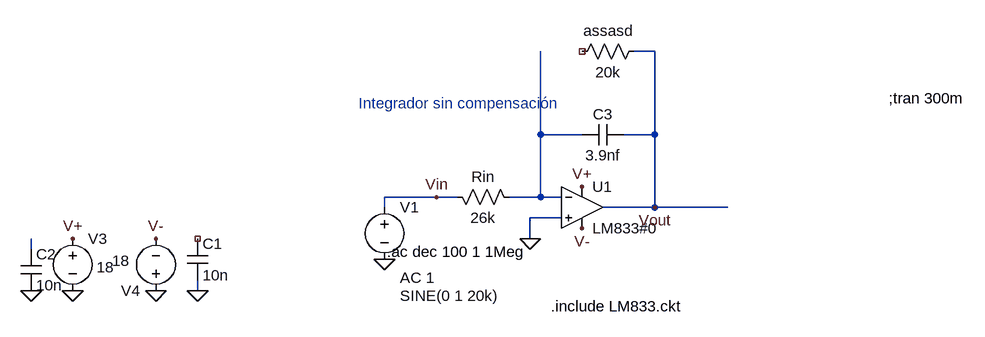
[diagram p0: schematic Integrador sin compensación.asc]
Integrador sin compensación.asc, the LTspice schematic file:
Version 4
SHEET 1 880 680
WIRE -656 -64 -688 -64
WIRE -832 64 -832 -64
WIRE -768 64 -832 64
WIRE -656 64 -656 -64
WIRE -656 64 -704 64
WIRE -992 160 -1072 160
WIRE -960 160 -992 160
WIRE -832 160 -832 64
WIRE -832 160 -880 160
WIRE -800 160 -832 160
WIRE -1072 176 -1072 160
WIRE -656 176 -656 64
WIRE -656 176 -736 176
WIRE -544 176 -656 176
WIRE -800 192 -848 192
WIRE -848 224 -848 192
WIRE -1616 240 -1616 224
WIRE -1360 304 -1360 288
FLAG -848 224 0
FLAG -768 208 V-
FLAG -656 176 Vout
FLAG -768 144 V+
FLAG -1424 304 0
FLAG -1552 304 0
FLAG -1552 224 V+
FLAG -1424 224 V-
FLAG -1072 256 0
FLAG -1616 304 0
FLAG -1360 304 0
FLAG -992 160 Vin
SYMBOL Opamps\\opamp2 -768 112 R0
SYMATTR InstName U1
SYMATTR Value LM833#0
SYMBOL res -976 144 M90
WINDOW 0 0 56 VBottom 2
WINDOW 3 32 56 VTop 2
SYMATTR InstName Rin
SYMATTR Value 26k
SYMBOL voltage -1552 208 R0
WINDOW 3 37 60 Left 2
WINDOW 123 0 0 Left 0
WINDOW 39 0 0 Left 0
SYMATTR Value 18
SYMATTR InstName V3
SYMBOL voltage -1424 320 R180
WINDOW 3 40 62 Left 2
WINDOW 123 0 0 Left 0
WINDOW 39 0 0 Left 0
SYMATTR Value 18
SYMATTR InstName V4
SYMBOL cap -768 80 R270
WINDOW 0 32 32 VTop 2
WINDOW 3 0 32 VBottom 2
SYMATTR InstName C3
SYMATTR Value 3.9nf
SYMBOL cap -1376 224 R0
SYMATTR InstName C1
SYMATTR Value 10n
SYMBOL cap -1632 240 R0
SYMATTR InstName C2
SYMATTR Value 10n
SYMBOL res -672 -80 R90
WINDOW 0 0 56 VBottom 2
WINDOW 3 32 56 VTop 2
SYMATTR InstName assasd
SYMATTR Value 20k
SYMBOL voltage -1072 160 R0
WINDOW 3 24 152 Left 2
WINDOW 123 24 124 Left 2
WINDOW 39 0 0 Left 0
SYMATTR InstName V1
SYMATTR Value SINE(0 1 20k)
SYMATTR Value2 AC 1
TEXT -816 328 Left 2 !.include LM833.ckt
TEXT -1112 16 Left 2 ;Integrador sin compensación
TEXT -1068 244 Left 2 !.ac dec 100 1 1Meg
TEXT -296 8 Left 2 !;tran 300m

The netlist it stands for:
* Integrador sin compensación.asc
XU1 0 N001 V+ V- Vout LM833#0  ; pins In+ In- V+ V- OUT
Rin Vin N001 26k
V3 V+ 0 18
V4 0 V- 18
C3 N001 Vout 3.9nf
C1 NC_01 0 10n
C2 N002 0 10n
R§assasd Vout NC_02 20k
V1 Vin 0 SINE(0 1 20k) AC 1
.include LM833.ckt
* Integrador sin compensación
.ac dec 100 1 1Meg
;tran 300m
.backanno
.end